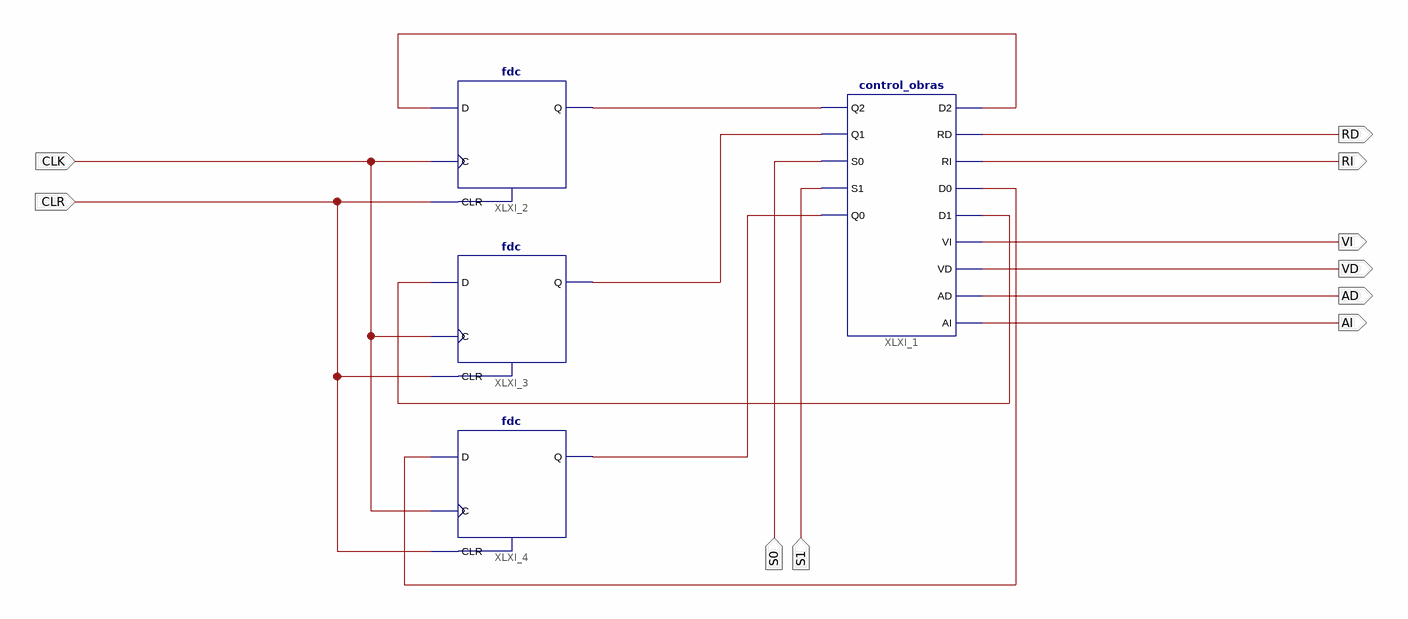
[diagram p0: schematic sheet 1]
// Xilinx ISE schematic p4ej1.sch (spartan3) as structural Verilog: 4 symbols, 10 ports
module p4ej1 (
  input  S1,
  input  S0,
  input  CLR,
  input  CLK,
  output AI,
  output AD,
  output VD,
  output VI,
  output RI,
  output RD
);

  wire XLXN_9, XLXN_10, XLXN_11, XLXN_16, XLXN_20, XLXN_21;

  control_obras XLXI_1 (
    .AD(AD), .AI(AI), .D0(XLXN_20), .D1(XLXN_21), .D2(XLXN_16), .Q0(XLXN_11), .Q1(XLXN_10), .Q2(XLXN_9),
    .RD(RD), .RI(RI), .S0(S0), .S1(S1), .VD(VD), .VI(VI));
  fdc XLXI_2 (.C(CLK), .CLR(CLR), .D(XLXN_16), .Q(XLXN_9));
  fdc XLXI_3 (.C(CLK), .CLR(CLR), .D(XLXN_21), .Q(XLXN_10));
  fdc XLXI_4 (.C(CLK), .CLR(CLR), .D(XLXN_20), .Q(XLXN_11));
endmodule
